# EAGLE design clockBot_userInterface (EAGLE 9.6.2)
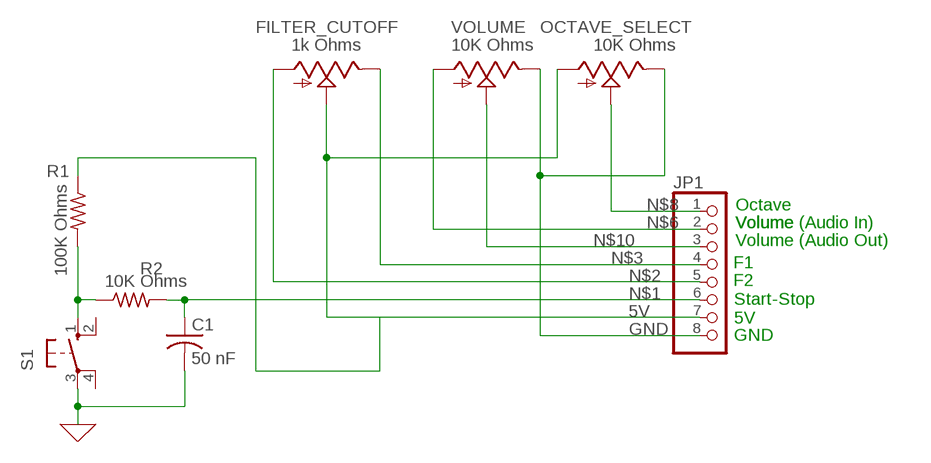
[diagram p0: schematic, sheet 1]

## Parts
C1  50 nF  C-US025-025X050  [C025-025X050]
FILTER_CUTOFF  1k Ohms  TRIM_US-S64W  [S64W]
JP1  PINHD-1X8  [1X08]
OCTAVE_SELECT  10K Ohms  TRIM_US-S64W  [S64W]
R1  100K Ohms  R-US_0204/7  [0204/7]
R2  10K Ohms  R-US_0204/7  [0204/7]
S1  10-XX  [B3F-10XX]
VOLUME  10K Ohms  TRIM_US-S64W  [S64W]

## Nets
0: C1.2 S1.3(P) ; supply symbol labelled GND
5V: FILTER_CUTOFF.S JP1.7 OCTAVE_SELECT.A R1.1
GND: JP1.8 OCTAVE_SELECT.E VOLUME.E
N$1: C1.1 JP1.6 R2.2
N$2: FILTER_CUTOFF.A JP1.5
N$3: FILTER_CUTOFF.E JP1.4
N$6: JP1.2 VOLUME.A
N$7: R1.2 R2.1 S1.1(S)
N$8: JP1.1 OCTAVE_SELECT.S
N$10: JP1.3 VOLUME.S
Unconnected: S1.2(S1) S1.4(P1)

## Notes on the sheet
- Octave
- Volume | Volume (Audio In)
- Volume (Audio Out)
- F1
- F2
- Start-Stop
- 5V
- GND

## Library data of the parts
C1 = adafruit:C-US: CAPACITOR, American symbol
FILTER_CUTOFF OCTAVE_SELECT VOLUME = pot:TRIM_US-: POTENTIOMETER
JP1 = pinhead:PINHD-1X8: PIN HEADER
R1 R2 = rcl:R-US_: RESISTOR, American symbol; SPICEPREFIX: R
S1 = switch-omron:10-XX: OMRON SWITCH; MPN: B3F-1000; OC_FARNELL: 176432; OC_NEWARK: 36M3542

## Board
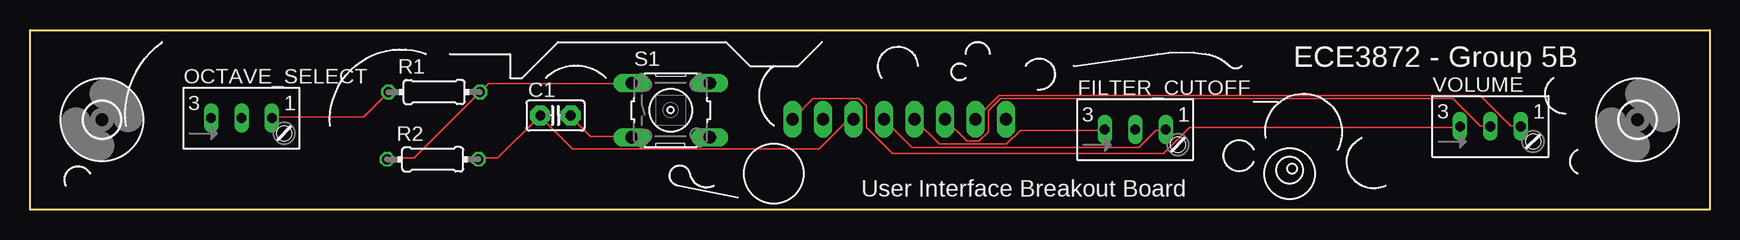
[diagram p1: board, top side]
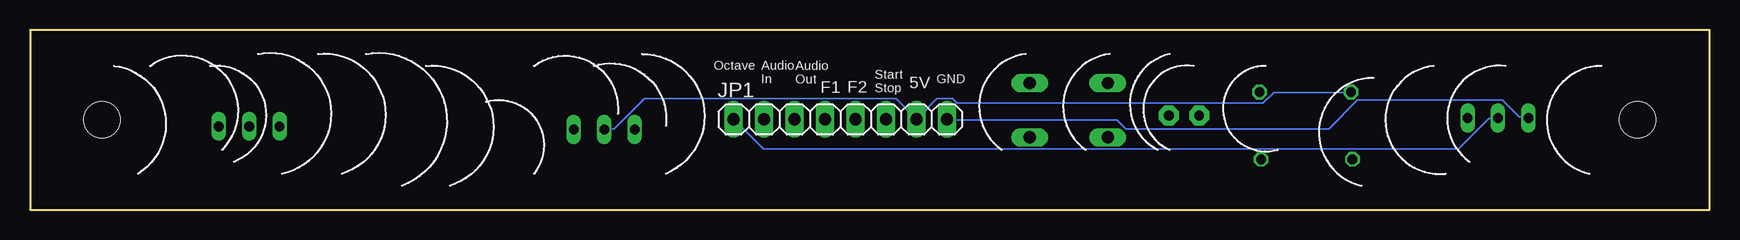
[diagram p2: board, bottom side, seen from below]

Size 140 x 15 mm. Coordinates in mm from the lower left corner, seen from the top.
Outline: 0,0 0,15 140,15 140,0 0,0
Copper layers (1*16): Top 0.035559375mm / dielectric 1.6mm / Bottom 0.035559375mm
Design rules "jlcpcb2layer": minimum track width 5mil, minimum drill 12mil, track to track 5mil, track to pad 5mil, pad to pad 5mil, via to via 5mil, smd to smd 5mil, copper to edge 8mil, drill to drill 6mil, minimum pad ring 5mil, minimum via ring 3mil, stop-mask expansion 2.5mil, vias tented up to drill 0mil, thermal gap 10mil

### Footprints (pad centres in the part's own frame; a part is rotated, then mirrored left to right if it is on the bottom)
C025-025X050 = drill 0.813 pad 1.676 octagon: 1 -1.27,0; 2 1.27,0
S64W = drill 0.813 long: A 2.54,1.27; E -2.54,1.27; S 0,1.27
1X08 = drill 1.016 long: 1 -8.89,0; 2 -6.35,0; 3 -3.81,0; 4 -1.27,0; 5 1.27,0; 6 3.81,0; 7 6.35,0; 8 8.89,0
0204/7 = drill 0.813 octagon: 1 -3.81,0; 2 3.81,0
B3F-10XX = drill 1.016 long: 1 -3.251,2.261; 2 3.251,2.261; 3 -3.251,-2.261; 4 3.251,-2.261
3,0 = hole 3: 0,0

### Placement (x,y rotation side)
C1  43.8,7.86 0 top
FILTER_CUTOFF  92.13,5.42 0 top
JP1  72.46,7.54 0 bottom
OCTAVE_SELECT  17.63,6.37 0 top
R1  33.69,9.81 0 top
R2  33.57,4.19 0 top
S1  53.41,8.3 0 top
U$1  [3,0]  134,7.5 0 top
U$2  [3,0]  6,7.5 0 top
VOLUME  121.74,5.68 0 top

### Tracks (layer width: path | path; a pad name or v marks a point on that pad's centre or on a via)
0
  Top 0.127: S1.3 50.04,6.1 46.74,6.1 45.09,7.75 C1.2
5V
  Top 0.127: OCTAVE_SELECT.A 20.19,7.75 27.81,7.75 29.84,9.78 R1.1
  Bottom 0.127: FILTER_CUTOFF.S 92.08,6.73 91.31,6.73 88.77,9.27 67.82,9.27 66.17,7.62 JP1.7 66.04,7.62 64.39,9.27 63.12,9.27 62.74,8.89 37.21,8.89 36.32,9.78 29.97,9.78 R1.1
GND
  Top 0.127: VOLUME.E 119.13,6.86 96.65,6.86 94.49,4.7 71.88,4.7 69.72,6.86 69.72,8.64 69.09,9.27 65.28,9.27 63.63,7.62 JP1.8
  Bottom 0.127: OCTAVE_SELECT.E 15.11,7.75 15.88,7.75 17.27,9.14 29.34,9.14 31.75,6.73 48.64,6.73 49.4,7.49 63.5,7.49 JP1.8
N$1
  Top 0.127: R2.2 37.47,4.32 38.99,4.32 42.42,7.75 C1.1 42.55,7.75 45.21,5.08 65.79,5.08 68.2,7.49 68.58,7.49 JP1.6
N$2
  Top 0.127: FILTER_CUTOFF.A 94.61,6.6 93.85,6.6 92.46,5.21 73.53,5.21 71.25,7.49 JP1.5
N$3
  Top 0.127: FILTER_CUTOFF.E 89.53,6.6 82.55,6.6 81.41,5.46 75.82,5.46 73.79,7.49 JP1.4
N$6
  Top 0.127: VOLUME.A 124.21,6.99 123.44,6.99 120.9,9.53 80.77,9.53 78.87,7.62 JP1.2
N$7
  Top 0.127: R2.1 29.84,4.32 32,4.32 37.47,9.78 R1.2 37.59,9.91 38.23,10.54 50.04,10.54 S1.1
N$8
  Bottom 0.127: OCTAVE_SELECT.S 17.65,7.62 18.41,7.62 20.95,5.08 78.87,5.08 81.28,7.49 JP1.1
N$10
  Top 0.127: VOLUME.S 121.67,6.99 120.9,6.99 118.62,9.27 80.9,9.27 79.88,8.26 79.88,6.48 79.12,5.71 78.11,5.71 76.33,7.49 JP1.3

### Text on the board
tPlace: ECE3872 - Group 5B | User Interface Breakout Board
bPlace: Octave | GND | Audio / In | 5V | Start / Stop | F2 | F1 | Audio / Out